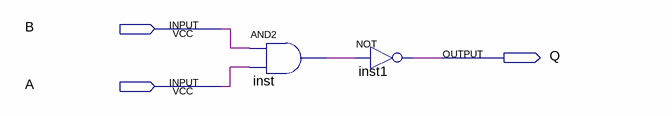
[diagram p0: schematic sheet]
// Quartus schematic TopLeft.bdf as structural Verilog: 2 symbols, 3 pins
module TopLeft (
  input  B,
  input  A,
  output Q
);

  wire inst_out;

  and inst (inst_out, B, A);
  not inst1 (Q, inst_out);
endmodule
